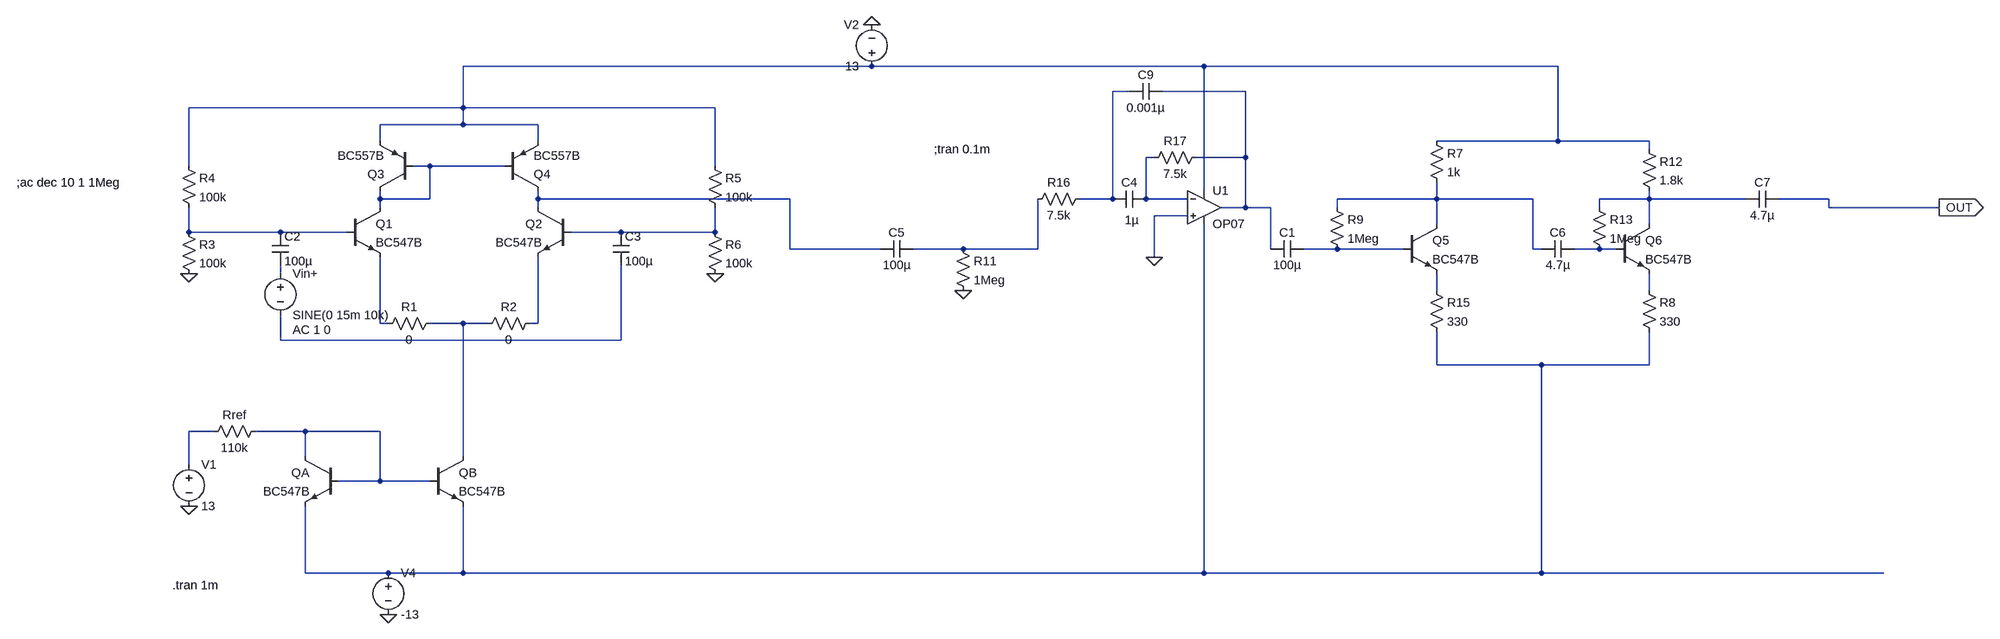
[diagram p0: schematic BJT_Diff_amp_Gain_DE_4_diff_in_negIn_gain_high_filter_right_2nd_stage.asc]
BJT_Diff_amp_Gain_DE_4_diff_in_negIn_gain_high_filter_right_2nd_stage.asc, the LTspice schematic file:
Version 4
SHEET 1 3572 1044
WIRE 1072 -192 160 -192
WIRE 1712 -192 1072 -192
WIRE 2400 -192 1712 -192
WIRE 1568 -144 1536 -144
WIRE 1792 -144 1632 -144
WIRE 160 -112 160 -192
WIRE 160 -112 -368 -112
WIRE 752 -112 160 -112
WIRE 160 -80 160 -112
WIRE 160 -80 0 -80
WIRE 304 -80 160 -80
WIRE 0 -48 0 -80
WIRE 304 -48 304 -80
WIRE 2400 -48 2400 -192
WIRE 2400 -48 2160 -48
WIRE 2576 -48 2400 -48
WIRE 2576 -32 2576 -48
WIRE 1616 -16 1600 -16
WIRE 1792 -16 1792 -144
WIRE 1792 -16 1696 -16
WIRE -368 0 -368 -112
WIRE 96 0 64 0
WIRE 240 0 96 0
WIRE 752 0 752 -112
WIRE 1712 48 1712 -192
WIRE 0 64 0 48
WIRE 96 64 96 0
WIRE 96 64 0 64
WIRE 304 64 304 48
WIRE 896 64 304 64
WIRE 1536 64 1536 -144
WIRE 1536 64 1472 64
WIRE 1600 64 1600 -16
WIRE 1680 64 1600 64
WIRE 2160 64 2160 32
WIRE 2160 64 1968 64
WIRE 2352 64 2160 64
WIRE 2576 64 2576 48
WIRE 2576 64 2480 64
WIRE 2800 64 2576 64
WIRE 2960 64 2864 64
WIRE 0 80 0 64
WIRE 304 80 304 64
WIRE 1792 80 1792 -16
WIRE 1792 80 1744 80
WIRE 1840 80 1792 80
WIRE 1968 80 1968 64
WIRE 2480 80 2480 64
WIRE 2960 80 2960 64
WIRE 3296 80 2960 80
WIRE 1680 96 1616 96
WIRE 2160 112 2160 64
WIRE 2576 112 2576 64
WIRE -368 128 -368 80
WIRE -192 128 -368 128
WIRE -64 128 -192 128
WIRE 464 128 368 128
WIRE 752 128 752 80
WIRE 752 128 464 128
WIRE 896 160 896 64
WIRE 1088 160 896 160
WIRE 1248 160 1152 160
WIRE 1392 160 1392 64
WIRE 1392 160 1248 160
WIRE 1840 160 1840 80
WIRE 1968 160 1904 160
WIRE 2096 160 1968 160
WIRE 2352 160 2352 64
WIRE 2368 160 2352 160
WIRE 2480 160 2432 160
WIRE 2512 160 2480 160
WIRE 1616 176 1616 96
WIRE -192 208 -192 192
WIRE 2160 240 2160 208
WIRE 2576 240 2576 208
WIRE 0 304 0 176
WIRE 16 304 0 304
WIRE 160 304 96 304
WIRE 208 304 160 304
WIRE 304 304 304 176
WIRE 304 304 288 304
WIRE -192 336 -192 288
WIRE 464 336 464 192
WIRE 464 336 -192 336
WIRE 2160 384 2160 320
WIRE 2368 384 2160 384
WIRE 2576 384 2576 320
WIRE 2576 384 2368 384
WIRE -320 512 -368 512
WIRE -144 512 -240 512
WIRE 0 512 -144 512
WIRE -144 560 -144 512
WIRE 160 560 160 304
WIRE -368 576 -368 512
WIRE 0 608 0 512
WIRE 0 608 -80 608
WIRE 96 608 0 608
WIRE -144 880 -144 656
WIRE 16 880 -144 880
WIRE 160 880 160 656
WIRE 160 880 16 880
WIRE 1712 880 1712 112
WIRE 1712 880 160 880
WIRE 2368 880 2368 384
WIRE 2368 880 1712 880
WIRE 3136 880 2368 880
FLAG -368 656 0
FLAG -368 208 0
FLAG 752 208 0
FLAG 1248 240 0
FLAG 3296 80 OUT
IOPIN 3296 80 Out
FLAG 16 960 0
FLAG 1072 -272 0
FLAG 1616 176 0
SYMBOL npn 368 80 M0
SYMATTR InstName Q2
SYMATTR Value BC547B
SYMBOL npn -64 80 R0
SYMATTR InstName Q1
SYMATTR Value BC547B
SYMBOL res 112 288 R90
WINDOW 0 0 56 VBottom 2
WINDOW 3 32 56 VTop 2
SYMATTR InstName R1
SYMATTR Value 0
SYMBOL res 304 288 R90
WINDOW 0 0 56 VBottom 2
WINDOW 3 32 56 VTop 2
SYMATTR InstName R2
SYMATTR Value 0
SYMBOL npn 96 560 R0
SYMATTR InstName QB
SYMATTR Value BC547B
SYMBOL npn -80 560 M0
SYMATTR InstName QA
SYMATTR Value BC547B
SYMBOL res -224 496 R90
WINDOW 0 0 56 VBottom 2
WINDOW 3 32 56 VTop 2
SYMATTR InstName Rref
SYMATTR Value 110k
SYMBOL voltage -192 192 R0
WINDOW 123 24 124 Left 2
WINDOW 39 0 0 Left 0
SYMATTR Value2 AC 1 0
SYMATTR InstName Vin+
SYMATTR Value SINE(0 15m 10k)
SYMBOL voltage -368 560 R0
WINDOW 123 0 0 Left 0
WINDOW 39 0 0 Left 0
SYMATTR InstName V1
SYMATTR Value 13
SYMBOL cap -208 128 R0
SYMATTR InstName C2
SYMATTR Value 100µ
SYMBOL res -384 112 R0
SYMATTR InstName R3
SYMATTR Value 100k
SYMBOL res -384 -16 R0
SYMATTR InstName R4
SYMATTR Value 100k
SYMBOL res 736 -16 R0
SYMATTR InstName R5
SYMATTR Value 100k
SYMBOL res 736 112 R0
SYMATTR InstName R6
SYMATTR Value 100k
SYMBOL npn 2096 112 R0
SYMATTR InstName Q5
SYMATTR Value BC547B
SYMBOL res 2144 -64 R0
SYMATTR InstName R7
SYMATTR Value 1k
SYMBOL cap 1904 144 R90
WINDOW 0 0 32 VBottom 2
WINDOW 3 32 32 VTop 2
SYMATTR InstName C1
SYMATTR Value 100µ
SYMBOL res 1232 144 R0
SYMATTR InstName R11
SYMATTR Value 1Meg
SYMBOL cap 1152 144 R90
WINDOW 0 0 32 VBottom 2
WINDOW 3 32 32 VTop 2
SYMATTR InstName C5
SYMATTR Value 100µ
SYMBOL npn 2512 112 R0
SYMATTR InstName Q6
SYMATTR Value BC547B
SYMBOL res 2560 224 R0
SYMATTR InstName R8
SYMATTR Value 330
SYMBOL cap 2432 144 R90
WINDOW 0 0 32 VBottom 2
WINDOW 3 32 32 VTop 2
SYMATTR InstName C6
SYMATTR Value 4.7µ
SYMBOL res 2560 -48 R0
SYMATTR InstName R12
SYMATTR Value 1.8k
SYMBOL res 2144 224 R0
SYMATTR InstName R15
SYMATTR Value 330
SYMBOL res 2464 64 R0
SYMATTR InstName R13
SYMATTR Value 1Meg
SYMBOL res 1952 64 R0
SYMATTR InstName R9
SYMATTR Value 1Meg
SYMBOL cap 448 128 R0
SYMATTR InstName C3
SYMATTR Value 100µ
SYMBOL cap 1600 48 R90
WINDOW 0 0 32 VBottom 2
WINDOW 3 41 27 VTop 2
SYMATTR InstName C4
SYMATTR Value 1µ
SYMBOL res 1488 48 R90
WINDOW 0 0 56 VBottom 2
WINDOW 3 32 56 VTop 2
SYMATTR InstName R16
SYMATTR Value 7.5k
SYMBOL OpAmps\\OP07 1712 16 R0
SYMATTR InstName U1
SYMBOL res 1712 -32 R90
WINDOW 0 0 56 VBottom 2
WINDOW 3 32 56 VTop 2
SYMATTR InstName R17
SYMATTR Value 7.5k
SYMBOL cap 1632 -160 R90
WINDOW 0 0 32 VBottom 2
WINDOW 3 32 32 VTop 2
SYMATTR InstName C9
SYMATTR Value 0.001µ
SYMBOL voltage 16 864 R0
WINDOW 123 0 0 Left 0
WINDOW 39 0 0 Left 0
SYMATTR InstName V4
SYMATTR Value -13
SYMBOL voltage 1072 -176 R180
WINDOW 0 24 96 Left 2
WINDOW 3 24 16 Left 2
WINDOW 123 0 0 Left 0
WINDOW 39 0 0 Left 0
SYMATTR InstName V2
SYMATTR Value 13
SYMBOL pnp 64 48 R180
SYMATTR InstName Q3
SYMATTR Value BC557B
SYMBOL pnp 240 48 M180
SYMATTR InstName Q4
SYMATTR Value BC557B
SYMBOL cap 2864 48 R90
WINDOW 0 0 32 VBottom 2
WINDOW 3 32 32 VTop 2
SYMATTR InstName C7
SYMATTR Value 4.7µ
TEXT -400 904 Left 2 !.tran 1m
TEXT -760 32 Left 2 !;ac dec 10 1 1Meg
TEXT 1192 -32 Left 2 !;tran 0.1m

The netlist it stands for:
* BJT_Diff_amp_Gain_DE_4_diff_in_negIn_gain_high_filter_right_2nd_stage.asc
Q2 N006 N010 N019 0 BC547B
Q1 N005 N009 N017 0 BC547B
R1 N018 N017 0
R2 N019 N018 0
QB N018 N023 N021 0 BC547B
QA N023 N023 N021 0 BC547B
Rref N023 N022 110k
Vin+ N014 N020 SINE(0 15m 10k) AC 1 0
V1 N022 0 13
C2 N009 N014 100µ
R3 N009 0 100k
R4 N001 N009 100k
R5 N001 N010 100k
R6 N010 0 100k
Q5 N007 N012 N015 0 BC547B
R7 N001 N007 1k
C1 N012 N003 100µ
R11 N011 0 1Meg
C5 N011 N006 100µ
Q6 N008 N013 N016 0 BC547B
R8 N016 N021 330
C6 N013 N007 4.7µ
R12 N001 N008 1.8k
R15 N015 N021 330
R13 N008 N013 1Meg
R9 N007 N012 1Meg
C3 N010 N020 100µ
C4 N004 N002 1µ
R16 N002 N011 7.5k
XU1 0 N004 N001 N021 N003 LT1001  ; OP07, pins In+ In- V+ V- OUT
R17 N003 N004 7.5k
C9 N003 N002 0.001µ
V4 N021 0 -13
V2 N001 0 13
Q3 N005 N005 N001 0 BC557B
Q4 N006 N005 N001 0 BC557B
C7 OUT N008 4.7µ
.model NPN NPN
.model PNP PNP
.lib standard.bjt
.tran 1m
;ac dec 10 1 1Meg
;tran 0.1m
.lib LTC.lib
.backanno
.end